# Altium schematic sheet 10_ToMeasOutUI.SchDoc
size A4; Organization: OLTEST; Revision: 01; SheetNumber: 10; SheetTotal: 13; Название листа: Название листа; Разработчик: Бондарчук С.; Прибор: R100; АМАК.000000.000 Э3: R100.230.030.000-00; Дата: 16.04.2019; Формат: A4; workspacename: R100_Boards_v1
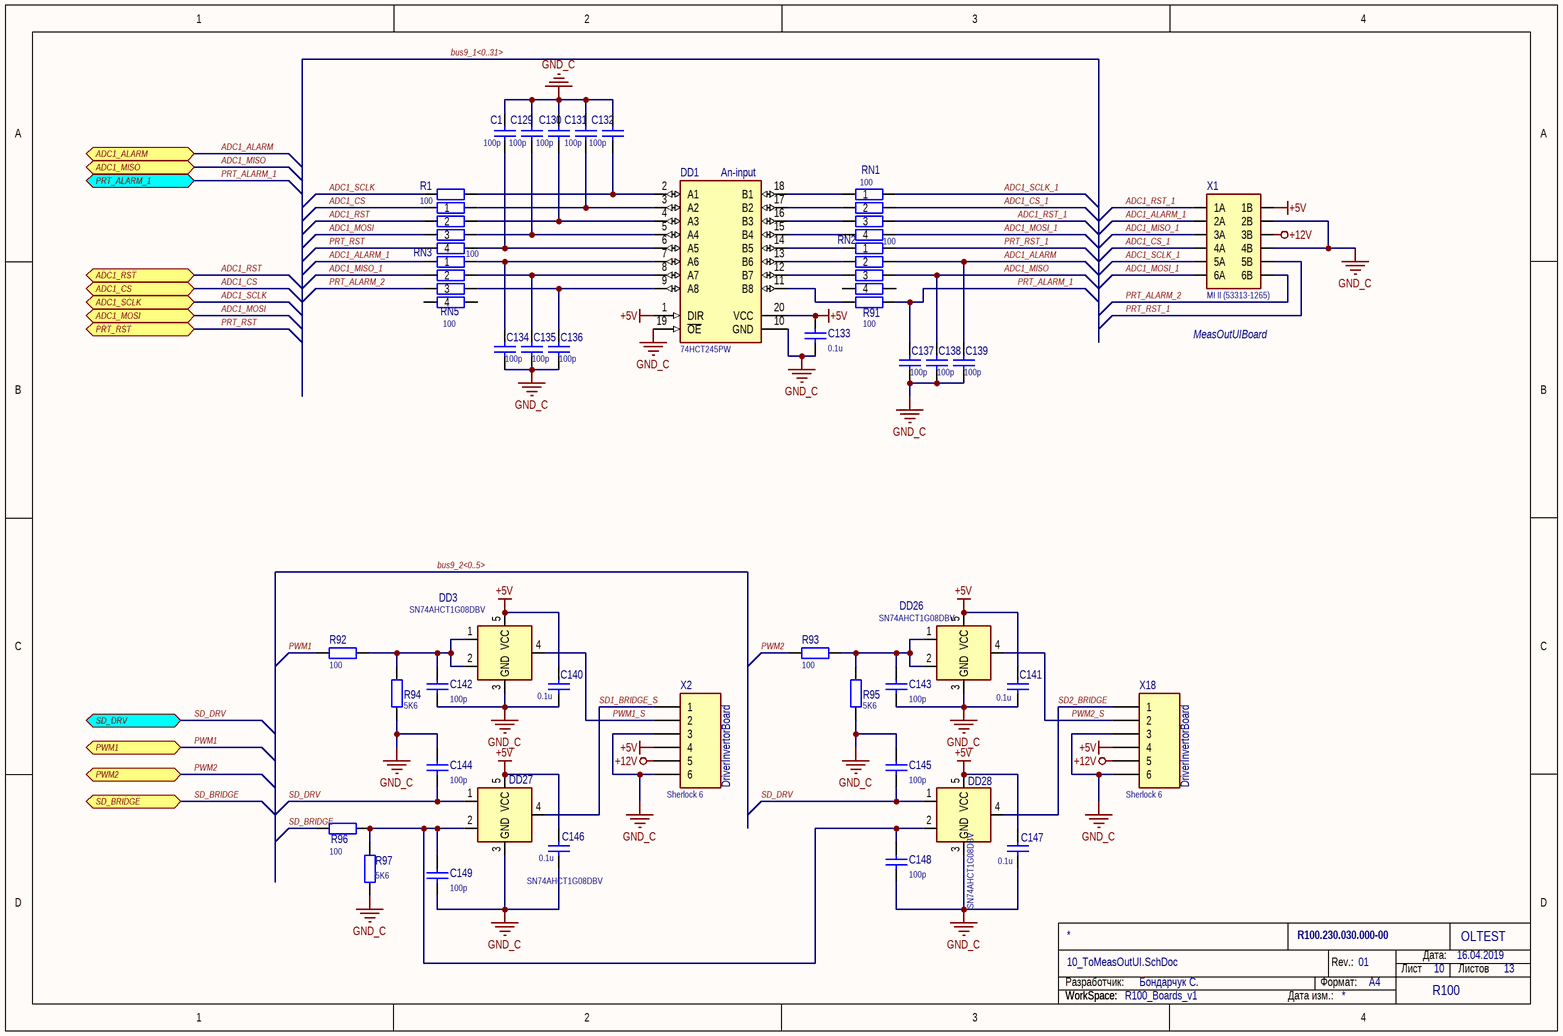
[diagram p0: 10_ToMeasOutUI.SchDoc]

## Parts
C1  100p  [SMD_C_0603]
C129  100p  [SMD_C_0603]
C130  100p  [SMD_C_0603]
C131  100p  [SMD_C_0603]
C132  100p  [SMD_C_0603]
C133  0.1u  [SMD_C_0603]
C134  100p  [SMD_C_0603]
C135  100p  [SMD_C_0603]
C136  100p  [SMD_C_0603]
C137  100p  [SMD_C_0603]
C138  100p  [SMD_C_0603]
C139  100p  [SMD_C_0603]
C140  0.1u  [SMD_C_0603]
C141  0.1u  [SMD_C_0603]
C142  100p  [SMD_C_0603]
C143  100p  [SMD_C_0603]
C144  100p  [SMD_C_0603]
C145  100p  [SMD_C_0603]
C146  0.1u  [SMD_C_0603]
C147  0.1u  [SMD_C_0603]
C148  100p  [SMD_C_0603]
C149  100p  [SMD_C_0603]
DD1  74HCT245PW  [PW0020A_M]
DD3  SN74AHCT1G08DBV  [SOT-23(DBV)]
DD26  SN74AHCT1G08DBV  [SOT-23(DBV)]
DD27  SN74AHCT1G08DBV  [SOT-23(DBV)]
DD28  SN74AHCT1G08DBV  [SOT-23(DBV)]
R1  100  [SMD_R_0603]
R91  100  [SMD_R_0603]
R92  100  [SMD_R_0603]
R93  100  [SMD_R_0603]
R94  5K6  [SMD_R_0603]
R95  5K6  [SMD_R_0603]
R96  100  [SMD_R_0603]
R97  5K6  [SMD_R_0603]
RN1  100  [CRA06S]
RN2  100  [CRA06S]
RN3  100  [CRA06S]
RN5  100  [CRA06S]
X1  MI II (53313-1265)  [53313-1265]
X2  Sherlock 6  [35362-0650]
X18  Sherlock 6  [35362-0650]

## Ports
ADC1_ALARM, ADC1_CS, ADC1_MISO, ADC1_MOSI, ADC1_RST, ADC1_SCLK, PRT_ALARM_1, PRT_RST, PWM1, PWM2, SD_BRIDGE, SD_DRV (bidir)

## Nets
+5V: C133.2 C140.2 C141.2 C146.2 C147.2 DD1.1(DIR) DD1.20(VCC) DD3.5(VCC) DD26.5(VCC) DD27.5(VCC) DD28.5(VCC) X1.1B X2.4 X18.4
+12V: X1.3B X2.5 X18.5
GND_C: C1.1 C129.1 C130.1 C131.1 C132.1 C133.1 C134.1 C135.1 C136.1 C137.1 C138.1 C139.1 C140.1 C141.1 C142.1 C143.1 C144.2 C145.2 C146.1 C147.1 C148.1 C149.1 DD1.10(GND) DD1.19(~{OE}) DD3.3(GND) DD26.3(GND) DD27.3(GND) DD28.3(GND) R94.1 R95.1 R97.1 X1.2B X1.4B X2.3 X2.6 X18.3 X18.6
ADC1_ALARM: C139.2 RN2.7 ; port ADC1_ALARM
ADC1_ALARM_1: RN5.1 X1.2A
ADC1_CS: RN3.1 ; port ADC1_CS
ADC1_CS_1: RN1.7 X1.4A
ADC1_MISO: C138.2 RN2.6 ; port ADC1_MISO
ADC1_MISO_1: RN5.2 X1.3A
ADC1_MOSI: RN3.3 ; port ADC1_MOSI
ADC1_MOSI_1: RN1.5 X1.6A
ADC1_RST: RN3.2 ; port ADC1_RST
ADC1_RST_1: RN1.6 X1.1A
ADC1_SCLK: R1.1 ; port ADC1_SCLK
ADC1_SCLK_1: RN1.8 X1.5A
PRT_ALARM_1: C137.2 R91.2 ; port PRT_ALARM_1
PRT_ALARM_2: RN5.3 X1.6B
PRT_RST: RN3.4 ; port PRT_RST
PRT_RST_1: RN2.8 X1.5B
PWM1: R92.1 ; port PWM1
PWM1_S: DD3.4 X2.2
PWM2: R93.1 ; port PWM2
PWM2_S: DD26.4 X18.2
SD1_BRIDGE_S: DD27.4 X2.1
SD2_BRIDGE: DD28.4 X18.1
SD_BRIDGE: R96.1 ; port SD_BRIDGE
SD_DRV: C144.1 C145.1 DD27.1 DD28.1 ; port SD_DRV
NetC1_2: C1.2 DD1.6(A5) RN3.5
NetC129_2: C129.2 DD1.5(A4) RN3.6
NetC130_2: C130.2 DD1.4(A3) RN3.7
NetC131_2: C131.2 DD1.3(A2) RN3.8
NetC132_2: C132.2 DD1.2(A1) R1.2
NetC134_2: C134.2 DD1.7(A6) RN5.8
NetC135_2: C135.2 DD1.8(A7) RN5.7
NetC136_2: C136.2 DD1.9(A8) RN5.6
NetC142_2: C142.2 DD3.1 DD3.2 R92.2 R94.2
NetC143_2: C143.2 DD26.1 DD26.2 R93.2 R95.2
NetC148_2: C148.2 C149.2 DD27.2 DD28.2 R96.2 R97.2
NetDD1_11: DD1.11(B8) R91.1
NetDD1_12: DD1.12(B7) RN2.3
NetDD1_13: DD1.13(B6) RN2.2
NetDD1_14: DD1.14(B5) RN2.1
NetDD1_15: DD1.15(B4) RN1.4
NetDD1_16: DD1.16(B3) RN1.3
NetDD1_17: DD1.17(B2) RN1.2
NetDD1_18: DD1.18(B1) RN1.1

Not connected (* = marked no-connect by the designer): RN2 4 5; RN5 4 5

## Buses and harness runs
bus bus9_1<0..31>
bus bus9_2<0..5>

## Notes on the sheet
- (near DD1) An-input
- MeasOutUIBoard
- (near X2) DriverInvertorBoard
- (near X18) DriverInvertorBoard
- Разработчик:
- Формат:
- Rev.:
- Лист
- Дата:
- Листов
- WorkSpace:
- Дата изм.:
- (in symbol SN74AHCT1G08DBV) &

## Library data of the parts
C1 C129-C132 C134-C139 C142-C145 C148 C149 = C0603 100p 100V 5%: SMD C 0603 MURATA 100V 5% NP0; PartNumber: GRM1885C2A101JA01; Manufacturer: MURATA; Value: 100p
C133 C140 C141 C146 C147 = C0603 0.1u 50V 10%: SMD C 0603 MURATA 50V 10% X7R; PartNumber: GRM188R71H104K; Manufacturer: MURATA; Value: 0.1u
DD1 = 74HCT245PW: Octal Bus Transceivers With 3-State Outputs, PW0020A; Manufacturer: NXP; PartNumber: 74HCT245PW
DD3 DD26-DD28 = SN74AHCT1G08DBV: 2-in AND; Manufacturer: Texas Instruments; PartNumber: SN74AHCT1G08DBV
R1 R91-R93 R96 = R0603 100 1%: SMD R 0603 VISHAY 0.1W 75V 1% 100ppm; PartNumber: CRCW0603100RFK; Manufacturer: VISHAY; Value: 100
R94 R95 R97 = R0603 5K6 1%: SMD R 0603 VISHAY 0.1W 75V 1% 100ppm; PartNumber: CRCW06035K60FK; Manufacturer: VISHAY; Value: 5K6
RN1-RN3 RN5 = CRA06S 4x100 1%: SMD RESISTOR ARRAY VISHAY 0.063W 50V 1% 100ppm; PartNumber: CRA06S083100RF; Manufacturer: VISHAY; Value: 100
X1 = 53313-1265: MI II 12 (6x2row), 2A 125V 2mm; Manufacturer: MOLEX; PartNumber: 53313-1265
X2 X18 = 35363-0650: Sherlock 6 Side, 2A 125V 2mm; Manufacturer: MOLEX; PartNumber: 35362-0650